# Altium schematic sheet Sheet1.SchDoc: Трёхфазный инвертор напряжения
size 420 x 297 mm; Date: 26.03.2020; CheckedBy: Климаш В.С.; Author: Ненюк В.В.; CompanyName: Кафедра ПЭ; Address1: Address1; Address2: Address2; Address3: Address3; Address4: Address4; DocumentNumber: 9ПЭМ1.2.06.000000 ЭЗ; Revision: ывывыфвыф; SheetNumber: 1; SheetTotal: 1; Scale: 1:1; Letter1Column: У; DocumentType: Схема электрическая принципиальная; FirstReferrence: 9ПЭМ1.2.06.000000 ЭЗ; DocumentFullPathAndName: ывы; DocumentName: ввывы; ImagePath: цууцу; ProjectName: вывывывывыфв
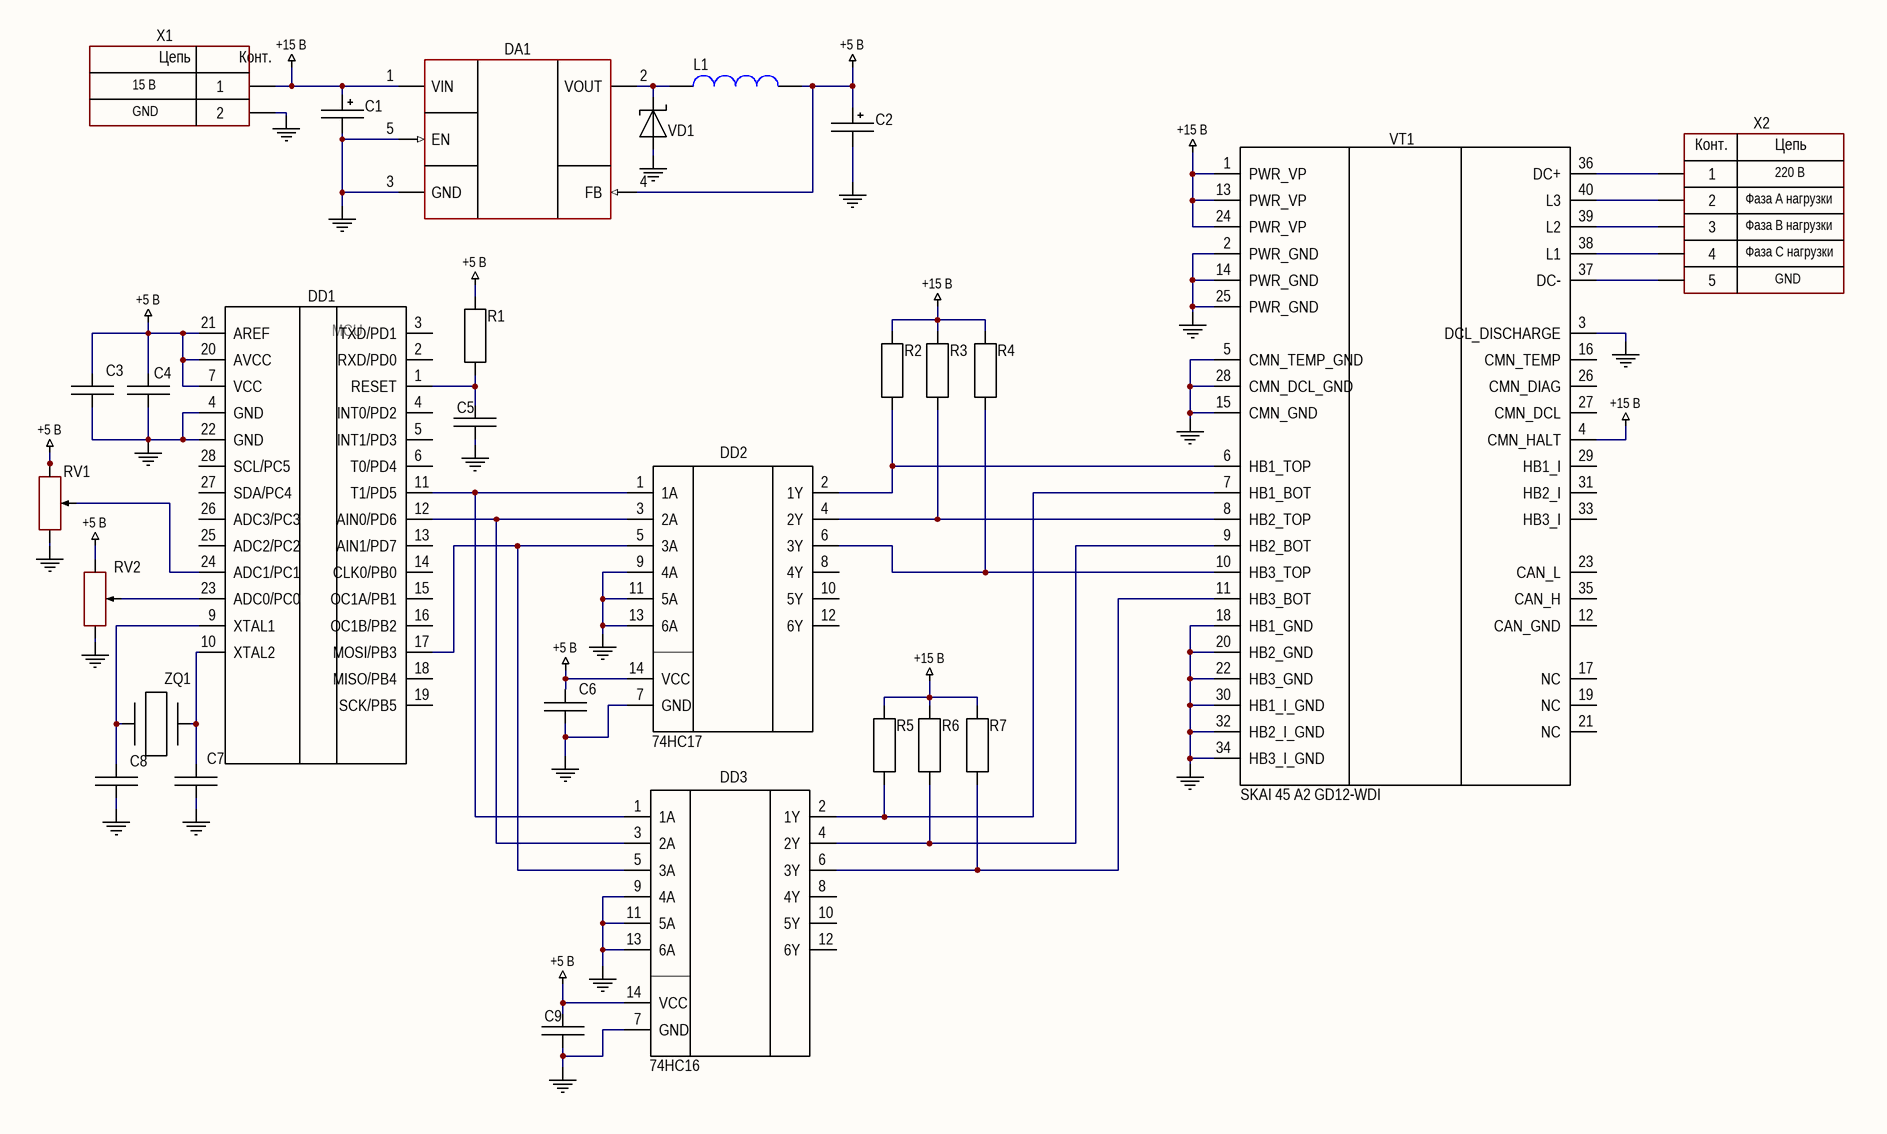
[diagram p0: Sheet1.SchDoc]

## Parts
C1  (no value)  [CAP: TANTAL-A]
C2  (no value)  [CAP: TANTAL-A]
C3  (no value)  [C0805]
C4  (no value)  [C0805]
C5  (no value)  [C0805]
C6  (no value)  [C0805]
C7  (no value)  [C0805]
C8  (no value)  [C0805]
C9  (no value)  [C0805]
DA1  (no value)  [SOT23-5]
DD1  (no value)
DD2  74HC17  [DIP-14]
DD3  74HC16  [DIP-14]
L1  (no value)  [IND: 0603]
R1  (no value)  [R_multilayer]
R2  (no value)  [R_multilayer]
R3  (no value)  [R_multilayer]
R4  (no value)  [R_multilayer]
R5  (no value)  [R_multilayer]
R6  (no value)  [R_multilayer]
R7  (no value)  [R_multilayer]
RV1  (no value)  [RES: 3296W]
RV2  (no value)  [RES: 3296W]
VD1  (no value)  [DIODE: SMA]
VT1  SKAI 45 A2 GD12-WDI
X1  (no value)  [CON: 6PCV-02-006]
X2  (no value)  [CON: SM05B-GHS]
ZQ1  (no value)

## Nets
+5 В: C2.1 C3.2 C4.2 C6.2 C9.2 DA1.4(FB) DD1.7(VCC) DD1.20(AVCC) DD1.21(AREF) DD2.14(VCC) DD3.14(VCC) L1.1 R1.2 RV1.1 RV2.1
+15 В: C1.1 DA1.1(VIN) R2.2 R3.2 R4.2 R5.2 R6.2 R7.2 VT1.1(PWR_VP) VT1.4(CMN_HALT) VT1.13(PWR_VP) VT1.24(PWR_VP) X1.1
GND: C1.2 C2.2 C3.1 C4.1 C5.1 C6.1 C7.1 C8.1 C9.1 DA1.3(GND) DA1.5(EN) DD1.4(GND) DD1.22(GND) DD2.7(GND) DD2.9(4A) DD2.11(5A) DD2.13(6A) DD3.7(GND) DD3.9(4A) DD3.11(5A) DD3.13(6A) RV1.3 RV2.3 VD1.1 VT1.2(PWR_GND) VT1.3(DCL_DISCHARGE) VT1.5(CMN_TEMP_GND) VT1.14(PWR_GND) VT1.15(CMN_GND) VT1.18(HB1_GND) VT1.20(HB2_GND) VT1.22(HB3_GND) VT1.25(PWR_GND) VT1.28(CMN_DCL_GND) VT1.30(HB1_I_GND) VT1.32(HB2_I_GND) VT1.34(HB3_I_GND) X1.2
NetC5_2: C5.2 DD1.1(RESET) R1.1
NetC7_2: C7.2 DD1.10(XTAL2) ZQ1.2
NetC8_2: C8.2 DD1.9(XTAL1) ZQ1.1
NetDA1_2: DA1.2(VOUT) L1.2 VD1.2
NetDD1_11: DD1.11(T1/PD5) DD2.1(1A) DD3.1(1A)
NetDD1_12: DD1.12(AIN0/PD6) DD2.3(2A) DD3.3(2A)
NetDD1_17: DD1.17(MOSI/PB3) DD2.5(3A) DD3.5(3A)
NetDD1_23: DD1.23(ADC0/PC0) RV2.2
NetDD1_24: DD1.24(ADC1/PC1) RV1.2
NetDD2_2: DD2.2(1Y) R2.1 VT1.6(HB1_TOP)
NetDD2_4: DD2.4(2Y) R3.1 VT1.8(HB2_TOP)
NetDD2_6: DD2.6(3Y) R4.1 VT1.10(HB3_TOP)
NetDD3_2: DD3.2(1Y) R5.1 VT1.7(HB1_BOT)
NetDD3_4: DD3.4(2Y) R6.1 VT1.9(HB2_BOT)
NetDD3_6: DD3.6(3Y) R7.1 VT1.11(HB3_BOT)
NetVT1_36: VT1.36(DC+) X2.1
NetVT1_37: VT1.37(DC-) X2.5
NetVT1_38: VT1.38(L1) X2.4
NetVT1_39: VT1.39(L2) X2.3
NetVT1_40: VT1.40(L3) X2.2

Not connected (* = marked no-connect by the designer): DD1 2(RXD/PD0) 3(TXD/PD1) 5(INT1/PD3) 6(T0/PD4) 13(AIN1/PD7) 14(CLK0/PB0) 15(OC1A/PB1) 16(OC1B/PB2) 18(MISO/PB4) 19(SCK/PB5) 25(ADC2/PC2) 26(ADC3/PC3) 27(SDA/PC4) 28(SCL/PC5); DD2 8(4Y) 10(5Y) 12(6Y); DD3 8(4Y) 10(5Y) 12(6Y); VT1 12(CAN_GND) 16(CMN_TEMP) 17(NC) 19(NC) 21(NC) 23(CAN_L) 26(CMN_DIAG) 27(CMN_DCL) 29(HB1_I) 31(HB2_I) 33(HB3_I) 35(CAN_H)

## Notes on the sheet
- 15 В
- GND
- Фаза А нагрузки
- 220 В
- Фаза C нагрузки
- Фаза B нагрузки
- Перв. примен.
- Справ. №
- Подп. и дата
- Инв. № дубл.
- Взам. инв. №
- Разраб.
- Изм.
- Лист
- № докум.
- Подп.
- Дата
- Лит.
- Масса
- Масштаб
- Пров.
- Т.контр.
- Листов
- Инв. № подл.
- Утв.
- Н.контр.
- 2.106-A3
- Копировал
- Формат А3
- (in symbol Connector_6PCV-02) Цепь; Конт.
- (in symbol Connector_SM05B) Конт.; Цепь

## Library data of the parts
C1 C2 = Tantal_A: Manufacturer: AVX; PartNumber: F930J107KAAAJ6; ValueManufacturerPartNumber: Tantalum capacitor, 100μF, 6.3V, ±10%, 2Ohm, case A (3216), -55...+125°C; Impedance: 2Ohm; Tolerance: ±10%; TypeDielectric: X7R; TypeCapacitor: Tantalum capacitor; Voltage: 6.3V; Value: 100μF; Package: case A (3216); HelpURL: https://www.digikey.com/product-detail/en/avx-corporation/F930J107KAAAJ6/478-12404-1-ND/9645231; Temperature: -55...+125°C
C3-C9 = Ceramic capacitor: Capacitor; Model: *; Manufacture: *; HelpURL: *; ComponentKind: *
DA1 = AP3429AKTTR-G1: Buck converter; Manufacturer: Diodes Incorporated; ValueManufacturerPartNumber: DC/DC buck converter, input 2.7...5.5V, 1MHz, output 0.6...5V, 2A, -40...+85°C, SOT23-6; VoltageInput: input 2.7...5.5V; Frequency: 1MHz; CurrentOutput: 2A; VoltageOutput: output 0.6...5V; HelpURL: https://www.digikey.com/product-detail/en/diodes-incorporated/AP3429AKTTR-G1/AP3429AKTTR-G1DICT-ND/5359842; Package: SOT23-6; ComponentType: DC/DC buck converter; Temperature: -40...+85°C
DD1 = ATmega328P: MCU; Manufacture: *; HelpURL: *; ComponentKind: *
DD2 = 74HC14: Hex buffer; Model: 74HC17; ComponentKind: DIP-14
DD3 = 74HC14: Hex inverter; Model: 74HC16; ComponentKind: DIP-14
L1 = Inductor_0603: Manufacturer: Murata Electronics; PartNumber: LQM18FN100M00D; ValueManufacturerPartNumber: Fixed inductor, 10μH, ±20%, 0603, 50mA, -55...+125°C; TypeInductor: Fixed inductor; MaxCurrent: 50mA; Tolerance: ±20%; Value: 10μH; Package: 0603; HelpURL: https://www.digikey.com/product-detail/en/murata-electronics-north-america/LQM18FN100M00D/490-4025-1-ND/1016285; Temperature: -55...+125°C
R1-R7 = Resistor: SMD Resistor; Model: *; Manufacture: *; HelpURL: *; ComponentKind: *
RV1 RV2 = Trimmer: Manufacturer: Bourns; PartNumber: 3296W-1-103LF; ValueManufacturerPartNumber: Resistor film, 10k, ±10%, 3296W, 0.5W, -55...+125°C; TypeResistor: Resistor film; Power: 0.5W; Tolerance: ±10%; Value: 10k; Package: 3296W; HelpURL: https://www.digikey.com/product-detail/en/bourns-inc/3296W-1-103LF/3296W-103LF-ND/1088045; Temperature: -55...+125°C
VD1 = Schottky_single: Manufacturer: Diodes Incorporated; ValueManufacturerPartNumber: Schottky diode, 80V, 500mA, 1V, 15pF, SOD-123, -55...+150°C; PartNumber: MBR0580S1-7; TypeDiode: Schottky diode; Voltage: 80V; Current: 500mA; VoltageDrop: 1V; RecoveryTime: 15pF; Package: SOD-123; HelpURL: https://www.digikey.com/product-detail/en/diodes-incorporated/MBR0580S1-7/MBR0580S1-7DICT-ND/5080371; Temperature: -55...+150°C
VT1 = SKAI_45: IGBT inverter; Model: SKAI 45 A2 GD12-WDI
X1 = Connector_6PCV-02: Manufacturer: TE Connectivity; ValueManufacturerPartNumber: Connector, 2pin, 9.53mm, 300VAC, 25A; PartNumber: 6PCV-02-006; VoltageMax: 300VAC; Pitch: 9.53mm; CurrentMax: 25A; Multichannel: 2pin; CommentText: "Разъем"; HelpURL: https://www.digikey.com/products/en?keywords=6PCV-02-006; TypeConnector: Connector
X2 = Connector_SM05B: Manufacturer: JST; ValueManufacturerPartNumber: Connector, 5pin, 1.25mm, 50VDC, 1A; PartNumber: SM05B-GHS; VoltageMax: 50VDC; Pitch: 1.25mm; CurrentMax: 1A; Multichannel: 5pin; CommentText: "Разъем"; HelpURL: https://www.digikey.com/product-detail/en/jst-sales-america-inc/SM05B-GHS-TB-LF-SN/455-1567-1-ND/807835; TypeConnector: Connector
ZQ1 = Crystal: Model: *; Manufacture: *; HelpURL: *; ComponentKind: *